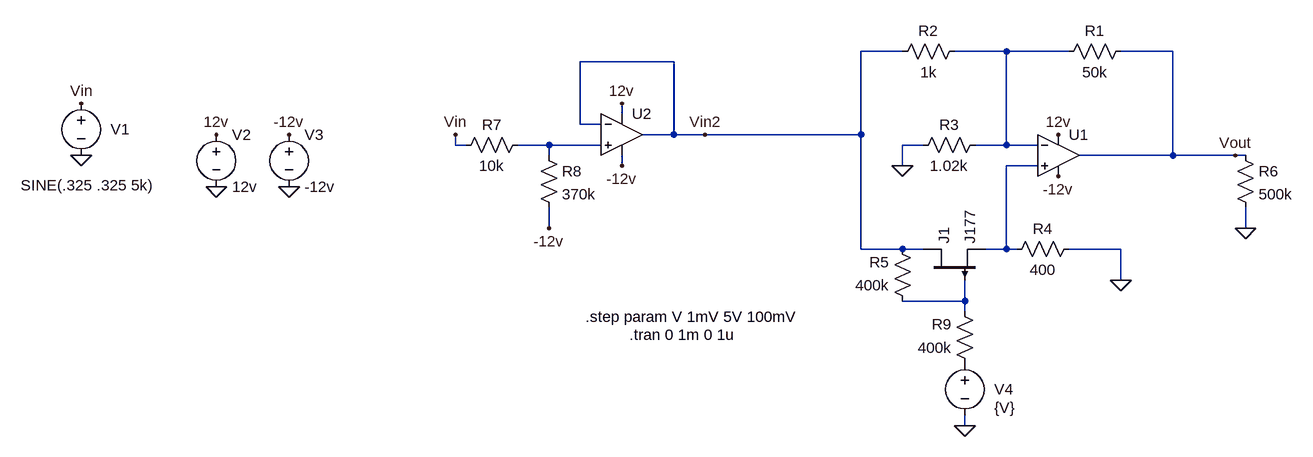
[diagram p0: schematic opampInv_and_notInv.asc]
opampInv_and_notInv.asc, the LTspice schematic file:
Version 4
SHEET 1 880 680
WIRE -3328 -1792 -3392 -1792
WIRE -3168 -1792 -3248 -1792
WIRE -3072 -1792 -3168 -1792
WIRE -2912 -1792 -2992 -1792
WIRE -3680 -1776 -3824 -1776
WIRE -3760 -1696 -3760 -1712
WIRE -3824 -1680 -3824 -1776
WIRE -3792 -1680 -3824 -1680
WIRE -3680 -1664 -3680 -1776
WIRE -3680 -1664 -3728 -1664
WIRE -3632 -1664 -3680 -1664
WIRE -3392 -1664 -3392 -1792
WIRE -3392 -1664 -3632 -1664
WIRE -4016 -1648 -4016 -1664
WIRE -4000 -1648 -4016 -1648
WIRE -3872 -1648 -3920 -1648
WIRE -3792 -1648 -3872 -1648
WIRE -3296 -1648 -3328 -1648
WIRE -3168 -1648 -3168 -1792
WIRE -3168 -1648 -3216 -1648
WIRE -3120 -1648 -3168 -1648
WIRE -3872 -1632 -3872 -1648
WIRE -2912 -1632 -2912 -1792
WIRE -2912 -1632 -3056 -1632
WIRE -2816 -1632 -2912 -1632
WIRE -2800 -1632 -2816 -1632
WIRE -3760 -1616 -3760 -1632
WIRE -3328 -1616 -3328 -1648
WIRE -3120 -1616 -3168 -1616
WIRE -3872 -1520 -3872 -1552
WIRE -2800 -1520 -2800 -1552
WIRE -3392 -1488 -3392 -1664
WIRE -3328 -1488 -3392 -1488
WIRE -3296 -1488 -3328 -1488
WIRE -3168 -1488 -3168 -1616
WIRE -3168 -1488 -3200 -1488
WIRE -3152 -1488 -3168 -1488
WIRE -2992 -1488 -3072 -1488
WIRE -2992 -1440 -2992 -1488
WIRE -3232 -1408 -3232 -1440
WIRE -3232 -1408 -3328 -1408
WIRE -3232 -1392 -3232 -1408
WIRE -3232 -1216 -3232 -1232
FLAG -2992 -1440 0
FLAG -4592 -1632 0
FLAG -3328 -1616 0
FLAG -2800 -1520 0
FLAG -2816 -1632 Vout
FLAG -4272 -1584 0
FLAG -4384 -1584 0
FLAG -4384 -1664 12v
FLAG -4272 -1664 -12v
FLAG -3088 -1600 -12v
FLAG -3088 -1664 12v
FLAG -4016 -1664 Vin
FLAG -3760 -1712 12v
FLAG -3760 -1616 -12v
FLAG -3872 -1520 -12v
FLAG -3232 -1216 0
FLAG -4592 -1712 Vin
FLAG -3632 -1664 Vin2
SYMBOL voltage -4592 -1728 R0
WINDOW 0 45 56 Left 2
WINDOW 3 -93 142 Left 2
WINDOW 123 0 0 Left 0
WINDOW 39 0 0 Left 0
SYMATTR InstName V1
SYMATTR Value SINE(.325 .325 5k)
SYMBOL res -2976 -1808 R90
WINDOW 0 0 56 VBottom 2
WINDOW 3 32 56 VTop 2
SYMATTR InstName R1
SYMATTR Value 50k
SYMBOL res -3232 -1808 R90
WINDOW 0 0 56 VBottom 2
WINDOW 3 32 56 VTop 2
SYMATTR InstName R2
SYMATTR Value 1k
SYMBOL res -3312 -1632 R270
WINDOW 0 32 56 VTop 2
WINDOW 3 0 56 VBottom 2
SYMATTR InstName R3
SYMATTR Value 1.02k
SYMBOL res -2816 -1648 R0
SYMATTR InstName R6
SYMATTR Value 500k
SYMBOL Opamps\\UniversalOpamp2 -3088 -1632 R0
SYMATTR InstName U1
SYMBOL voltage -4384 -1680 R0
WINDOW 123 0 0 Left 0
WINDOW 39 0 0 Left 0
SYMATTR InstName V2
SYMATTR Value 12v
SYMBOL voltage -4272 -1680 R0
WINDOW 123 0 0 Left 0
WINDOW 39 0 0 Left 0
SYMATTR InstName V3
SYMATTR Value -12v
SYMBOL Opamps\\UniversalOpamp2 -3760 -1664 R0
SYMATTR InstName U2
SYMBOL res -3888 -1648 R0
SYMATTR InstName R8
SYMATTR Value 370k
SYMBOL res -3904 -1664 R90
WINDOW 0 0 56 VBottom 2
WINDOW 3 32 56 VTop 2
SYMATTR InstName R7
SYMATTR Value 10k
SYMBOL voltage -3232 -1328 R0
WINDOW 0 45 56 Left 2
WINDOW 3 45 84 Left 2
WINDOW 123 0 0 Left 0
WINDOW 39 0 0 Left 0
SYMATTR InstName V4
SYMATTR Value {V}
SYMBOL pjf -3296 -1440 R270
SYMATTR InstName J1
SYMATTR Value J177
SYMBOL res -3056 -1504 R90
WINDOW 0 0 56 VBottom 2
WINDOW 3 32 56 VTop 2
SYMATTR InstName R4
SYMATTR Value 400
SYMBOL res -3312 -1392 R180
WINDOW 0 36 76 Left 2
WINDOW 3 36 40 Left 2
SYMATTR InstName R5
SYMATTR Value 400k
SYMBOL res -3216 -1296 R180
WINDOW 0 36 76 Left 2
WINDOW 3 36 40 Left 2
SYMATTR InstName R9
SYMATTR Value 400k
TEXT -3816 -1384 Left 2 !.step param V 1mV 5V 100mV
TEXT -3748 -1356 Left 2 !.tran 0 1m 0 1u

The netlist it stands for:
* opampInv_and_notInv.asc
V1 Vin 0 SINE(.325 .325 5k)
R1 Vout N001 50k
R2 N001 Vin2 1k
R3 0 N001 1.02k
R6 Vout 0 500k
XU1 N003 N001 12v -12v Vout level.2 Avol=1Meg GBW=10Meg Slew=10Meg ilimit=25m rail=0 Vos=0 phimargin=45 en=0 enk=0 in=0 ink=0 Rin=500Meg  ; pins IN+ IN- V+ V- OUT
V2 12v 0 12v
V3 -12v 0 -12v
XU2 N002 Vin2 12v -12v Vin2 level.2 Avol=1Meg GBW=10Meg Slew=10Meg ilimit=25m rail=0 Vos=0 phimargin=45 en=0 enk=0 in=0 ink=0 Rin=500Meg  ; pins IN+ IN- V+ V- OUT
R8 N002 -12v 370k
R7 N002 Vin 10k
V4 P001 0 {V}
J1 Vin2 N004 N003 J177
R4 0 N003 400
R5 N004 Vin2 400k
R9 P001 N004 400k
.model NJF NJF
.model PJF PJF
.lib standard.jft
.step param V 1mV 5V 100mV
.tran 0 1m 0 1u
.lib UniversalOpamps2.sub
.backanno
.end